# EAGLE design Esquematico_Germinador (EAGLE 9.6.2)
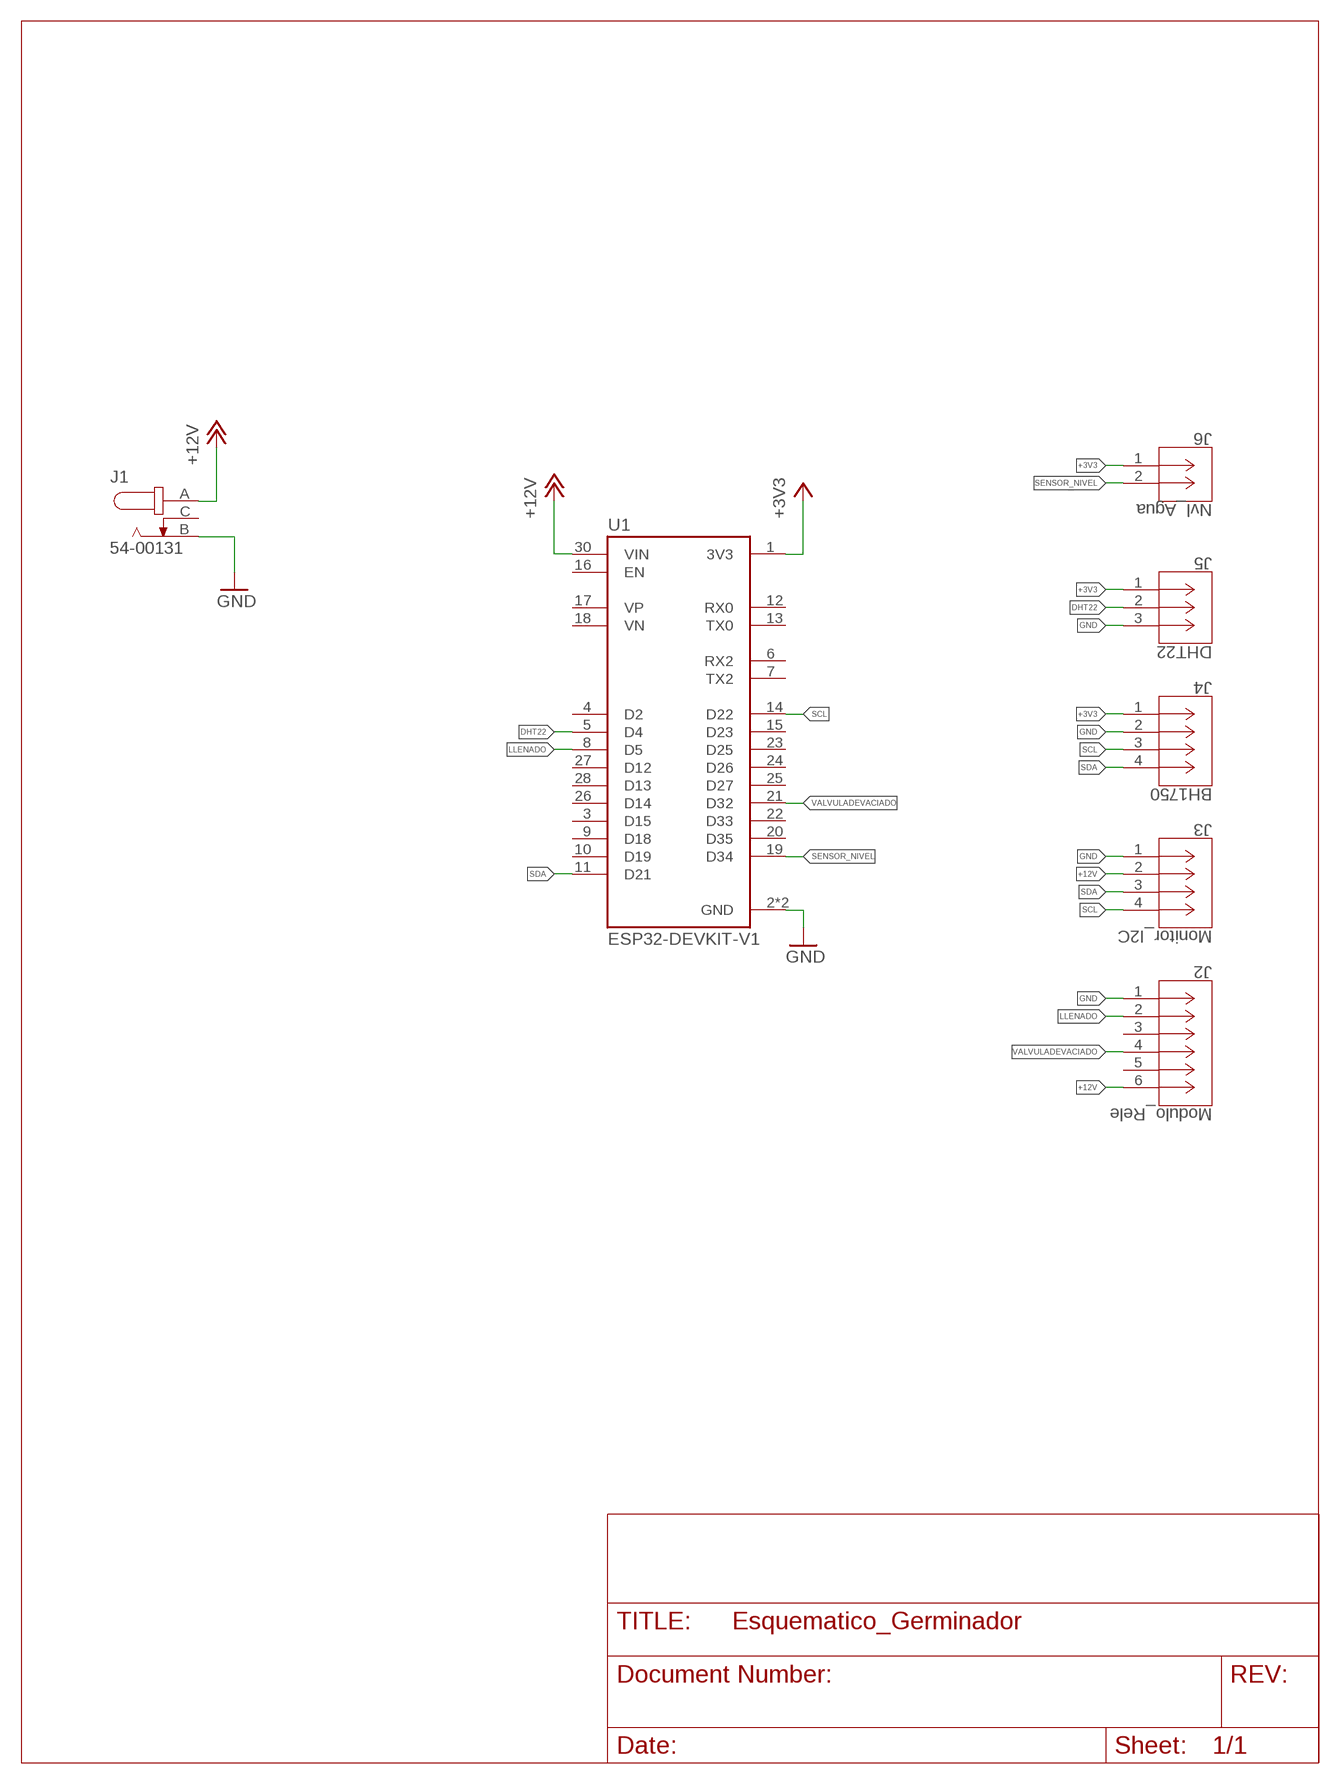
[diagram p0: schematic, sheet 1]

## Parts
J1  54-00131  [54-00131]
J2  Modulo_Rele  B6B-XH-A(LF)(SN)  [CONN_B6B-XH-A(LF)(SN)_JST]
J3  Monitor_I2C  B4B-XH-A_(LF)(SN)  [CONN_B4B-XH-A_(LF)(SN)_JST]
J4  BH1750  B4B-XH-A_(LF)(SN)  [CONN_B4B-XH-A_(LF)(SN)_JST]
J5  DHT22  B3B-XH-A(LF)(SN)  [CONN_B3B-XH-A_JST]
J6  Nvl_Agua  B2B-XH-A(LF)(SN)  [CONN_B2B-XH-A(LF)(SN)_JST]
U1  ESP32-DEVKIT-V1  [MODULE_ESP32_DEVKIT_V1]

## Nets
+3V3: J4.1 J5.1 J6.1 U1.1(3V3)
+12V: J1.A J2.6 J3.2 U1.30(VIN)
DHT22: J5.2 U1.5(D4)
GND: J1.B J2.1 J3.1 J4.2 J5.3 U1.2(GND) U1.29(GND)
LLENADO: J2.2 U1.8(D5)
SCL: J3.4 J4.3 U1.14(D22)
SDA: J3.3 J4.4 U1.11(D21)
SENSOR_NIVEL: J6.2 U1.19(D34)
VALVULADEVACIADO: J2.4 U1.21(D32)
Unconnected: J1.C J2.3 J2.5 U1.3(D15) U1.4(D2) U1.6(RX2) U1.7(TX2) U1.9(D18) U1.10(D19) U1.12(RX0) U1.13(TX0) U1.15(D23) U1.16(EN) U1.17(VP) U1.18(VN) U1.20(D35) U1.22(D33) U1.23(D25) U1.24(D26) U1.25(D27) U1.26(D14) U1.27(D12) U1.28(D13)

## Library data of the parts
J1 = CONECTORS:54-00131: 54-00131 CONN JACK R/A PCB 5.5X2.1MM Power Barrel Connector Jack 2.10mm ID (0.083"), 5.50mm OD (0.217") Through Hole, Right Angle
J2 = CONECTORS:B6B-XH-A(LF)(SN): B6B-XH-A(LF)(SN) CONN HEADER VERT 6POS 2.5MM Connector Header Through Hole 6 position 0.098" (2.50mm); BUILT_BY: EMA_Cory; COPYRIGHT: Copyright (C) 2018 Accelerated Designs. All rights reserved; MANUFACTURER_PART_NUMBER: B6B-XH-A(LF)(SN); SOURCELIBRARY: JST_2019-12-02; VENDOR: JST
J3 J4 = CONECTORS:B4B-XH-A_(LF)(SN): B4B-XH-A(LF)(SN) CONN HEADER VERT 4POS 2.5MM Connector Header Through Hole 4 position 0.098" (2.50mm); BUILT_BY: EMA_Cory; COPYRIGHT: Copyright (C) 2018 Accelerated Designs. All rights reserved; DATASHEET: http://www.jst-mfg.com/product/pdf/eng/eXH.pdf; MANUFACTURER_PART_NUMBER: B4B-XH-A (LF)(SN); SOURCELIBRARY: JST_2020-02-03; VENDOR: JST
J5 = CONECTORS:B3B-XH-A(LF)(SN): B3B-XH-A(LF)(SN) CONN HEADER VERT 3POS 2.5MM Connector Header Through Hole 3 position 0.098" (2.50mm); BUILT_BY: EMA_Cory; COPYRIGHT: Copyright (C) 2018 Accelerated Designs. All rights reserved; DATASHEET: https://www.jst-mfg.com/product/pdf/eng/eXH.pdf; MANUFACTURER_PART_NUMBER: B3B-XH-A(LF)(SN); SOURCELIBRARY: Add_to_database_2021-02-04; VENDOR: JST
J6 = CONECTORS:B2B-XH-A(LF)(SN): B2B-XH-A(LF)(SN) CONN HEADER VERT 2POS 2.5MM Connector Header Through Hole 2 position 0.098" (2.50mm); BUILT_BY: EMA_Cory; COPYRIGHT: Copyright (C) 2018 Accelerated Designs. All rights reserved; MANUFACTURER_PART_NUMBER: B2B-XH-A(LF)(SN); SOURCELIBRARY: JST_2019-12-02; VENDOR: JST
U1 = ESP32-DEVKIT-V1:ESP32-DEVKIT-V1: Dual core, Wi-Fi: 2.4 GHz up to 150 Mbits/s,BLE (Bluetooth Low Energy) and legacy Bluetooth, 32 bits, Up to 240 MHz Check availability <https://pricing.snapeda.com/parts/ESP32-DEVKIT-V1/Do%20it/view-part?ref=eda>; AVAILABILITY: Not in stock; CHECK_PRICES: https://www.snapeda.com/parts/ESP32-DEVKIT-V1/Do+it/view-part/?ref=eda; DESCRIPTION: Dual core, Wi-Fi: 2.4 GHz up to 150 Mbits/s,BLE (Bluetooth Low Energy) and legacy Bluetooth, 32 bits, Up to 240 MHz; MF: Do it; MP: ESP32-DEVKIT-V1; PACKAGE: None; PRICE: None; SNAPEDA_LINK: https://www.snapeda.com/parts/ESP32-DEVKIT-V1/Do+it/view-part/?ref=snap

## Board
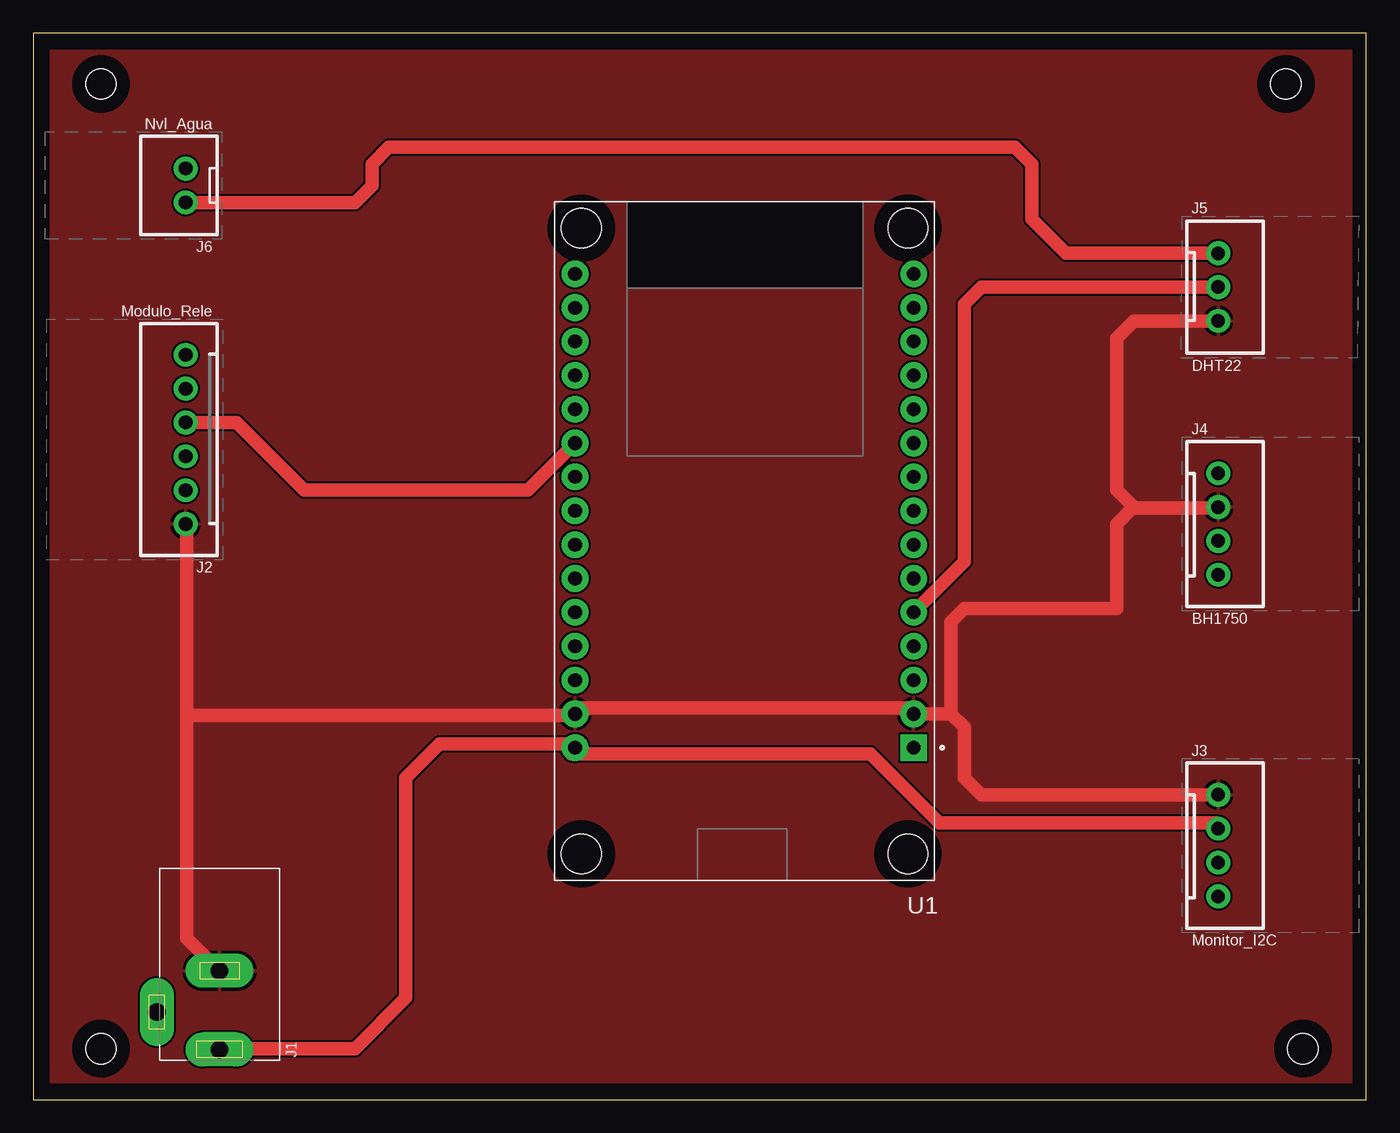
[diagram p1: board, top side]
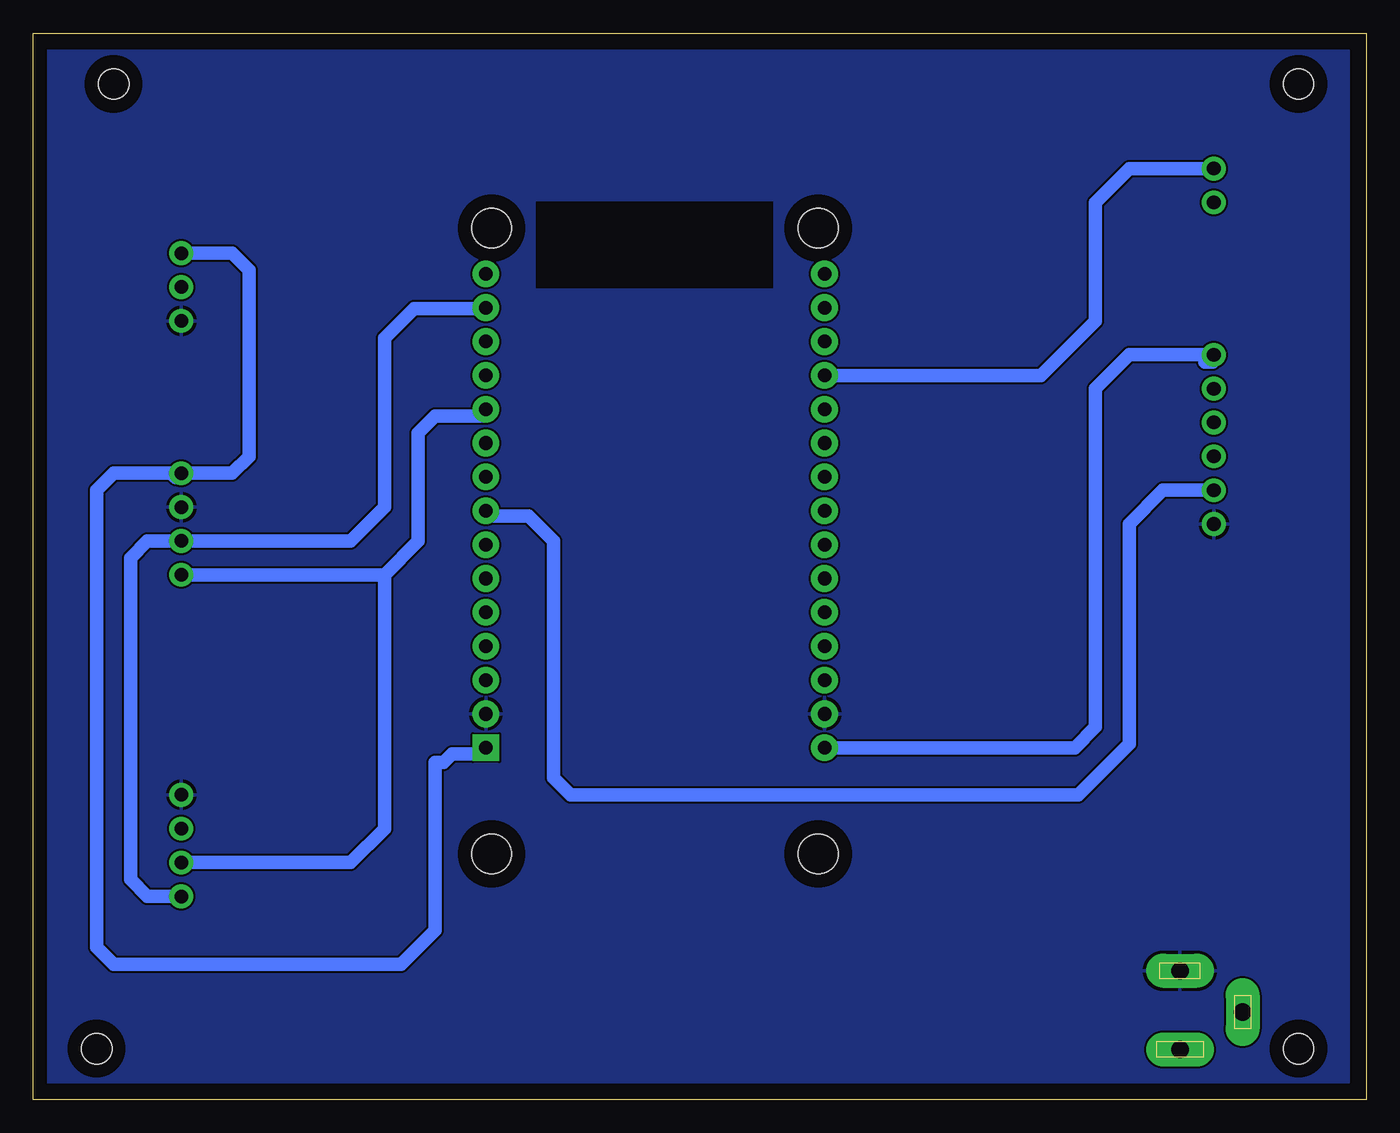
[diagram p2: board, bottom side, seen from below]

Size 100 x 80 mm. Coordinates in mm from the lower left corner, seen from the top.
Outline: 0,0 100,0 100,80 0,80 0,0
Copper layers (1*16): Top 1mm / dielectric 1.5mm / Bottom 1mm
Design rules "default *": minimum track width 1mm, minimum drill 0.35mm, track to track 6mil, track to pad 6mil, pad to pad 6mil, via to via 6mil, smd to smd 6mil, copper to edge 40mil, drill to drill 6mil, minimum pad ring 15mil, minimum via ring 8mil, stop-mask expansion 4mil, vias tented up to drill 0mil, thermal gap 10mil
Holes 2.29 mm at 5.08,76.2 93.98,76.2 5.08,3.81 95.25,3.81

### Footprints (pad centres in the part's own frame; a part is rotated, then mirrored left to right if it is on the bottom)
54-00131 = drill 1.3 pad 2.54 long: A -6.4,0; B -0.5,0; C -3.6,4.7
CONN_B6B-XH-A(LF)(SN)_JST = drill 1.016: 1 -6.35,0; 2 -3.81,0; 3 -1.27,0; 4 1.27,0; 5 3.81,0; 6 6.35,0
CONN_B4B-XH-A_(LF)(SN)_JST = drill 1.016: 1 -3.81,0; 2 -1.27,0; 3 1.27,0; 4 3.81,0
CONN_B3B-XH-A_JST = drill 1.016: 1 -2.54,0; 2 0,0; 3 2.54,0
CONN_B2B-XH-A(LF)(SN)_JST = drill 1.016: 1 -1.27,0; 2 1.27,0
MODULE_ESP32_DEVKIT_V1 = drill 1.02 pad 2 square: 1 -12.7,15.515 | drill 1.02 pad 2: 2 -12.7,12.975; 3 -12.7,10.435; 4 -12.7,7.895; 5 -12.7,5.355; 6 -12.7,2.815; 7 -12.7,0.275; 8 -12.7,-2.265; 9 -12.7,-4.805; 10 -12.7,-7.345; 11 -12.7,-9.885; 12 -12.7,-12.425; 13 -12.7,-14.965; 14 -12.7,-17.505; 15 -12.7,-20.045; 16 12.7,-20.045; 17 12.7,-17.505; 18 12.7,-14.965; 19 12.7,-12.425; 20 12.7,-9.885; 21 12.7,-7.345; 22 12.7,-4.805; 23 12.7,-2.265; 24 12.7,0.275; 25 12.7,2.815; 26 12.7,5.355; 27 12.7,7.895; 28 12.7,10.435; 29 12.7,12.975; 30 12.7,15.515 | hole 3: -12.28,-23.475; 12.23,-23.475; 12.23,23.475; -12.28,23.475

### Placement (x,y rotation side)
J1  13.97,10.16 90 top
J2  11.43,49.53 90 top
J3  88.9,19.05 270 top
J4  88.9,43.18 270 top
J5  88.9,60.96 270 top
J6  11.43,68.58 90 top
U1  53.34,41.91 180 top

### Tracks (layer width: path | path; a pad name or v marks a point on that pad's centre or on a via)
+3V3
  Top 1: J6.1 24.13,67.31 25.4,68.58 25.4,70.18 26.67,71.45 73.66,71.45 74.93,70.18 74.93,66.04 77.47,63.5 J5.1
  Bottom 1: U1.1 66.26,26.17 66.26,25.93 68.58,25.93 69.2,25.31 69.85,25.31 69.85,12.7 72.39,10.16 93.98,10.16 95.25,11.43 95.25,45.72 93.98,46.99 89.63,46.99 89.31,46.67 J4.1 85.09,46.99 83.82,48.26 83.82,62.23 85.09,63.5 J5.1
+12V
  Top 1: J3.2 88.73,20.74 67.99,20.74 62.81,25.93 40.91,25.93 U1.30 | 40.33,25.93 U1.30 | J1.A 14.02,3.81 24.13,3.81 27.94,7.62 27.94,24.13 30.48,26.67 40.37,26.67 U1.30
  Bottom 1: 12.1,55.31 11.52,55.31 | 11.52,55.31 J2.6 | 40.33,26.5 U1.30 21.86,26.39 20.32,27.94 20.32,53.34 17.78,55.88 12.09,55.88 11.52,55.31
DHT22
  Top 1: J5.2 71.12,60.96 69.85,59.69 69.85,40.37 U1.5
GND
  Top 1: 11.52,28.81 11.52,12.1 13.83,9.79 J1.B | 11.52,28.81 11.52,42.64 J2.1 | U1.2 65.69,29.39 40.91,29.39 U1.29 40.33,28.81 11.52,28.81 | 88.73,23.05 J3.1 71.12,22.86 69.85,24.13 69.85,27.94 68.86,28.93 | J4.2 88.73,44.37 82.63,44.37 81.28,45.72 81.28,57.15 82.55,58.42 J5.3 88.73,58.2 | 66.26,29.39 U1.2 | U1.2 68.86,28.93 | 68.86,28.93 68.86,35.84 69.85,36.83 81.28,36.83 81.28,43.18 82.47,44.37
  pour Top (isolate 0.018): 1.27,78.74 1.27,1.27 10.16,1.27 99.06,1.27 99.06,2.54 99.06,78.74
  pour Bottom (isolate 0.015): 1.27,1.27 99.06,1.27 99.06,78.74 1.27,78.74
LLENADO
  Bottom 1: U1.8 65.69,43.79 62.84,43.79 60.96,41.91 60.96,24.13 59.69,22.86 21.59,22.86 17.78,26.67 17.78,43.18 15.24,45.72 J2.2
SCL
  Bottom 1: U1.14 66.26,59.35 71.45,59.35 73.66,57.14 73.66,44.45 76.2,41.91 J4.3 91.44,41.91 92.71,40.64 92.71,16.51 91.44,15.24 J3.4
SDA
  Bottom 1: U1.11 66.26,51.28 69.85,51.28 71.12,50.01 71.12,41.91 73.66,39.37 | 73.66,39.37 J4.4 | 73.66,39.37 73.66,20.32 76.2,17.78 J3.3
SENSOR_NIVEL
  Bottom 1: J6.2 17.78,69.85 20.32,67.31 20.32,58.42 24.41,54.34 U1.19
VALVULADEVACIADO
  Top 1: J2.4 15.24,50.8 20.32,45.72 37.1,45.72 U1.21